# Altium schematic sheet System Diagram.SchDoc: System Diagram
size A4; SheetNumber: 1; SheetTotal: 6
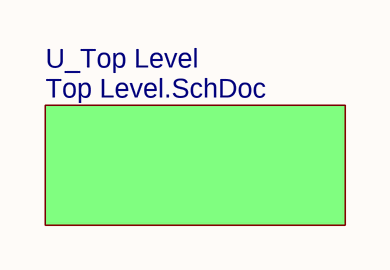
[diagram p0: System Diagram.SchDoc]

## Sub-sheets
U_Top Level = Top Level.SchDoc: no entries

## Notes on the sheet
- TITLE
- DRAWN BY
- DATE
- PROJECT
- FILE
- SHEET SIZE
- A4
- REVISION
- PAGE
- of